# EAGLE schematic teensyMotors01 (EAGLE 9.1.3)

## Sheet 1 of 2
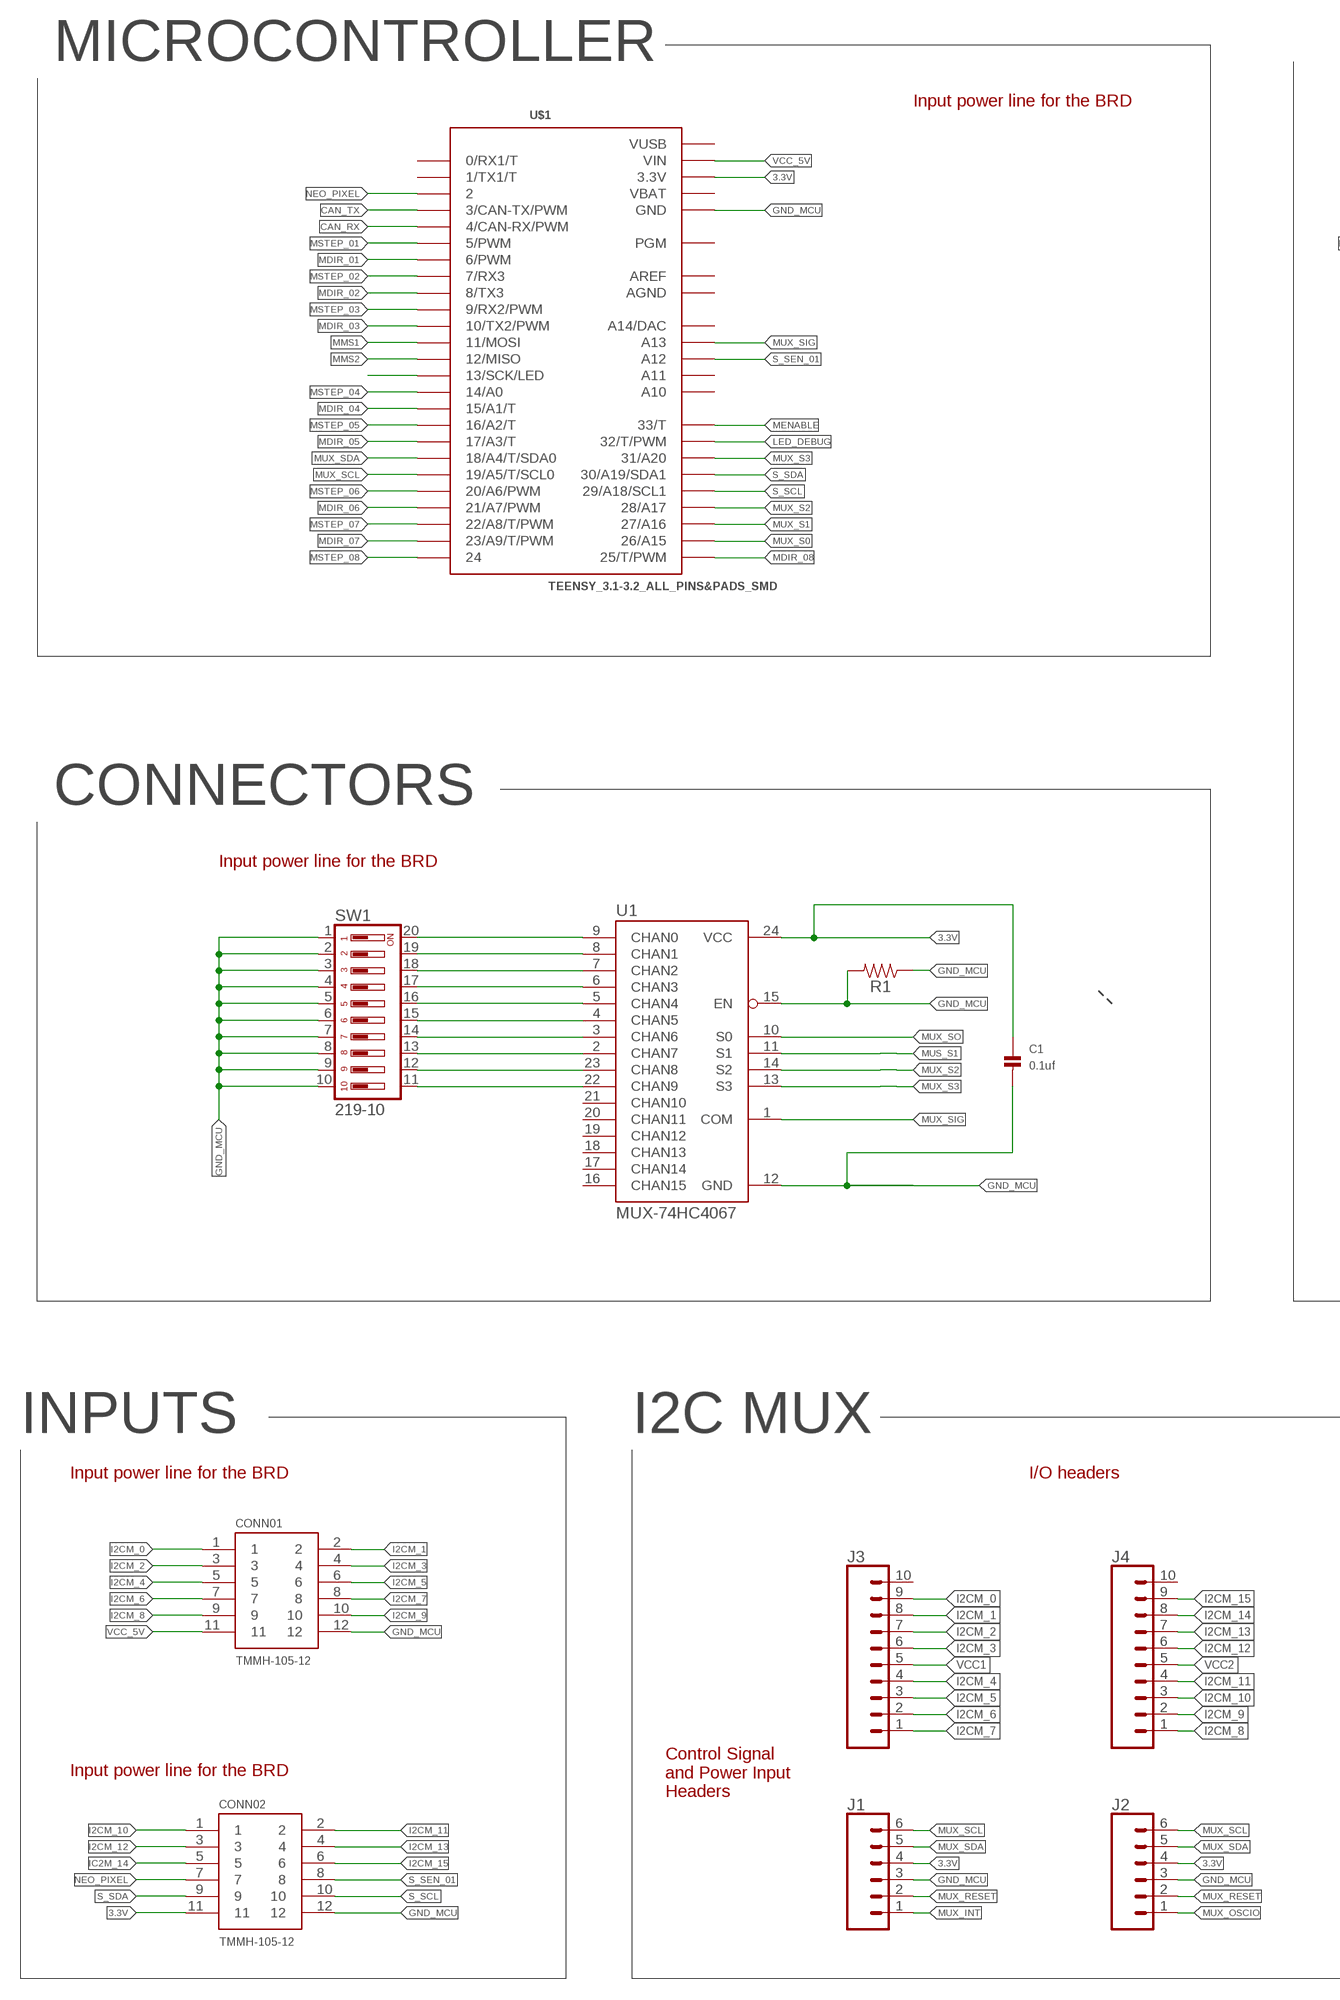
[diagram p0: schematic, sheet 1, part 1 of 2]
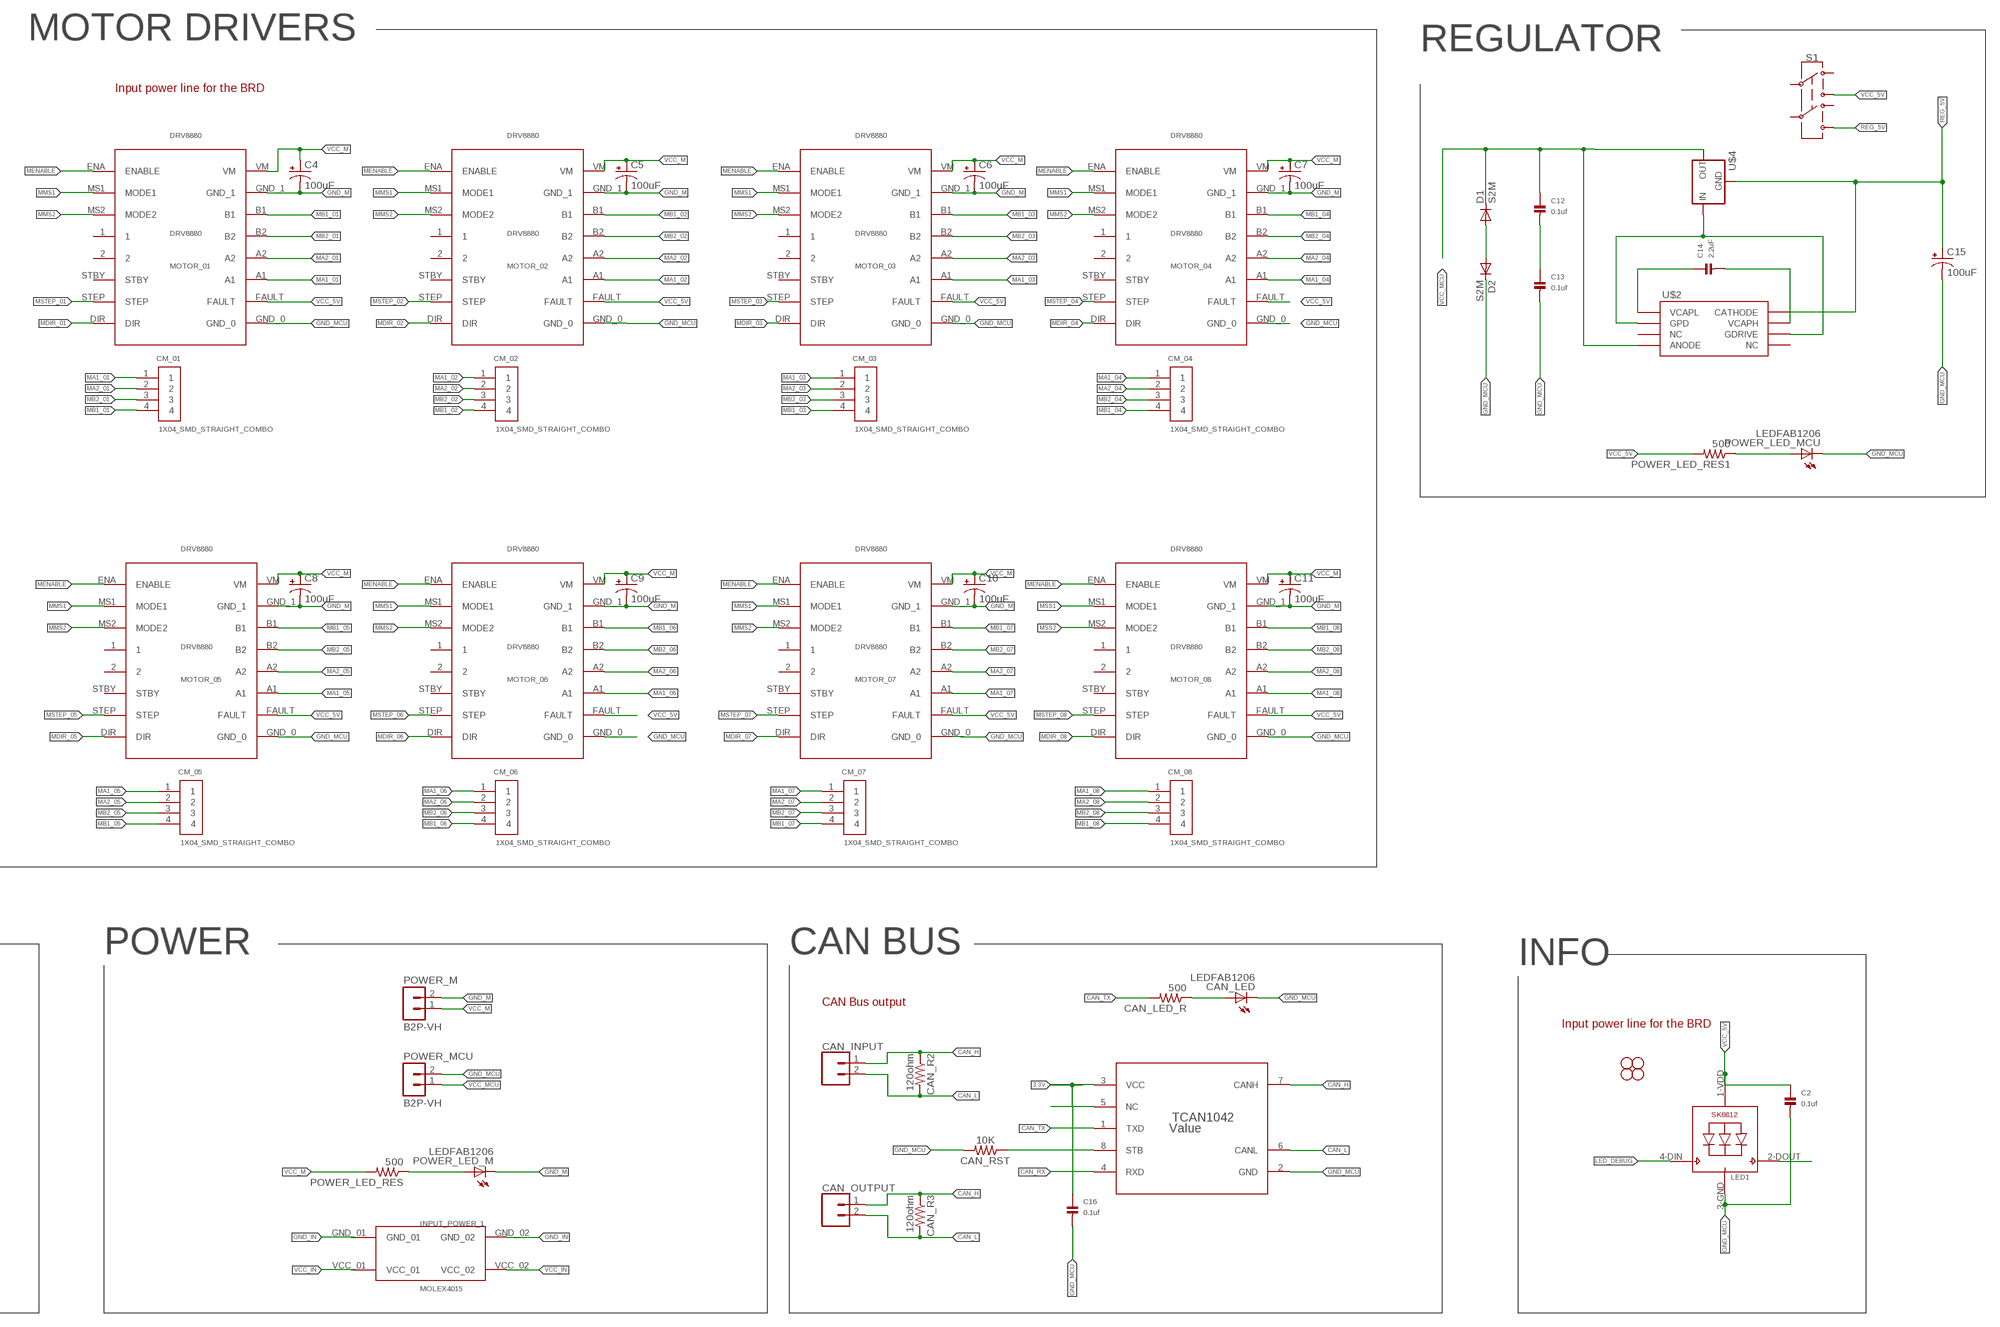
[diagram p1: schematic, sheet 1, part 2 of 2]

### Parts
C1  0.1uf  CAP_CERAMIC1206  [1206]
C2  0.1uf  CAP_CERAMIC1206  [1206]
C4  100uF  100UF-POLAR-25V-20%(ELEC)  [PANASONIC_D]
C5  100uF  100UF-POLAR-25V-20%(ELEC)  [PANASONIC_D]
C6  100uF  100UF-POLAR-25V-20%(ELEC)  [PANASONIC_D]
C7  100uF  100UF-POLAR-25V-20%(ELEC)  [PANASONIC_D]
C8  100uF  100UF-POLAR-25V-20%(ELEC)  [PANASONIC_D]
C9  100uF  100UF-POLAR-25V-20%(ELEC)  [PANASONIC_D]
C10  100uF  100UF-POLAR-25V-20%(ELEC)  [PANASONIC_D]
C11  100uF  100UF-POLAR-25V-20%(ELEC)  [PANASONIC_D]
C12  0.1uf  CAP_CERAMIC1206  [1206]
C13  0.1uf  CAP_CERAMIC1206  [1206]
C14  2.2uF  CAP_CERAMIC1206  [1206]
C15  100uF  100UF-POLAR-25V-20%(ELEC)  [PANASONIC_D]
C16  0.1uf  CAP_CERAMIC1206  [1206]
CAN_INPUT  CONN_02-JST-2MM-SMT  [JST-2-SMD]
CAN_LED  LEDFAB1206  [LED1206FAB]
CAN_LED_R  500  RES-US1206FAB  [R1206FAB]
CAN_OUTPUT  CONN_02-JST-2MM-SMT  [JST-2-SMD]
CAN_R2  120ohm  RESISTOR1206  [1206]
CAN_R3  120ohm  RESISTOR1206  [1206]
CAN_RST  10K  RESISTOR1206  [1206]
CM_01  1X04_SMD_STRAIGHT_COMBO  1X4-CLEANBIG  [1X04-CLEANBIG]
CM_02  1X04_SMD_STRAIGHT_COMBO  1X4-CLEANBIG  [1X04-CLEANBIG]
CM_03  1X04_SMD_STRAIGHT_COMBO  1X4-CLEANBIG  [1X04-CLEANBIG]
CM_04  1X04_SMD_STRAIGHT_COMBO  1X4-CLEANBIG  [1X04-CLEANBIG]
CM_05  1X04_SMD_STRAIGHT_COMBO  1X4-CLEANBIG  [1X04-CLEANBIG]
CM_06  1X04_SMD_STRAIGHT_COMBO  1X4-CLEANBIG  [1X04-CLEANBIG]
CM_07  1X04_SMD_STRAIGHT_COMBO  1X4-CLEANBIG  [1X04-CLEANBIG]
CM_08  1X04_SMD_STRAIGHT_COMBO  1X4-CLEANBIG  [1X04-CLEANBIG]
CONN01  TMMH-105-12  [TMMH-105-12]
CONN02  TMMH-105-12  [TMMH-105-12]
D1  S2M  [DO214AA]
D2  S2M  [DO214AA]
INPUT_POWER_1  MOLEX4015  [MOLEX4015]
J1  CONN_06SMD_MALE  [1X06_SMD_MALE]
J2  CONN_06SMD_MALE  [1X06_SMD_MALE]
J3  CONN_10SMD_MALE  [1X10_SMD_MALE]
J4  CONN_10SMD_MALE  [1X10_SMD_MALE]
LED1  SK6812_5050N  [LED5050_N]
MOTOR_01  DRV8880  [DRV8880]
MOTOR_02  DRV8880  [DRV8880]
MOTOR_03  DRV8880  [DRV8880]
MOTOR_04  DRV8880  [DRV8880]
MOTOR_05  DRV8880  [DRV8880]
MOTOR_06  DRV8880  [DRV8880]
MOTOR_07  DRV8880  [DRV8880]
MOTOR_08  DRV8880  [DRV8880]
POWER_LED_M  LEDFAB1206  [LED1206FAB]
POWER_LED_MCU  LEDFAB1206  [LED1206FAB]
POWER_LED_RES  500  RES-US1206FAB  [R1206FAB]
POWER_LED_RES1  500  RES-US1206FAB  [R1206FAB]
POWER_M  B2P-VH  [B2P-VH]
POWER_MCU  B2P-VH  [B2P-VH]
R1  RESISTOR1206  [1206]
S1  SWITCH-DPDT-SMD-AYZ0202  [SWITCH_DPDT_SMD_AYZ0202]
STANDOFF5  STAND-OFF  [STAND-OFF]
STANDOFF6  STAND-OFF  [STAND-OFF]
STANDOFF7  STAND-OFF  [STAND-OFF]
STANDOFF8  STAND-OFF  [STAND-OFF]
SW1  219-10  [CTS-219-10]
TCAN1042  Value  TCAN1042DRQ1  [D0008A_N]
U1  MUX-74HC4067  MUX-74HC4067SMD  [SSOP24]
U$1  TEENSY_3.1-3.2_ALL_PINS&PADS_SMD  [TEENSY_3.0-3.2_ALL_PINS_&_PADS_SMD]
U$2  LM74610-Q1  [VSSOP(8)]
U$4  BUK  [TO263-3]

### Nets
3.3V: C1.1 C16.1 CONN02.11 J1.4 J2.4 TCAN1042.3(VCC) U1.24(VCC) U$1.3.3V U$1.3.3V1(3.3V) U$1.3.3V2(3.3V)
C0: SW1.20 U1.9(CHAN0)
C1: SW1.19 U1.8(CHAN1)
C2: SW1.18 U1.7(CHAN2)
C3: SW1.17 U1.6(CHAN3)
C4: SW1.16 U1.5(CHAN4)
C5: SW1.15 U1.4(CHAN5)
C6: SW1.14 U1.3(CHAN6)
C7: SW1.13 U1.2(CHAN7)
C8: SW1.12 U1.23(CHAN8)
C9: SW1.11 U1.22(CHAN9)
CAN_H: CAN_INPUT.1 CAN_OUTPUT.1 CAN_R2.1 CAN_R3.1 TCAN1042.7(CANH)
CAN_L: CAN_INPUT.2 CAN_OUTPUT.2 CAN_R2.2 CAN_R3.2 TCAN1042.6(CANL)
CAN_RX: TCAN1042.4(RXD) U$1.4(4/CAN-RX/PWM)
CAN_TX: CAN_LED_R.2 TCAN1042.1(TXD) U$1.3(3/CAN-TX/PWM)
GND_IN: INPUT_POWER_1.GND_01 INPUT_POWER_1.GND_02
GND_M: C4.- C5.- C6.- C7.- C8.- C9.- C10.- C11.- MOTOR_01.GND_1 MOTOR_02.GND_1 MOTOR_03.GND_1 MOTOR_04.GND_1 MOTOR_05.GND_1 MOTOR_06.GND_1 MOTOR_07.GND_1 MOTOR_08.GND_1 POWER_LED_M.2(C) POWER_M.2
GND_MCU: C1.2 C2.2 C13.2 C15.- C16.2 CAN_LED.2(C) CAN_RST.2 CONN01.12 CONN02.12 D2.C J1.3 J2.3 LED1.3-GND(GND) MOTOR_01.GND_0 MOTOR_02.GND_0 MOTOR_03.GND_0 MOTOR_04.GND_0 MOTOR_05.GND_0 MOTOR_06.GND_0 MOTOR_07.GND_0 MOTOR_08.GND_0 POWER_LED_MCU.2(C) POWER_MCU.2 R1.1 R1.2 SW1.1 SW1.2 SW1.3 SW1.4 SW1.5 SW1.6 SW1.7 SW1.8 SW1.9 SW1.10 TCAN1042.2(GND) U1.12(GND) U1.15(EN) U$1.GND U$1.GND1(GND) U$1.GND2(GND)
I2CM_0: CONN01.1 J3.9
I2CM_1: CONN01.2 J3.8
I2CM_2: CONN01.3 J3.7
I2CM_3: CONN01.4 J3.6
I2CM_4: CONN01.5 J3.4
I2CM_5: CONN01.6 J3.3
I2CM_6: CONN01.7 J3.2
I2CM_7: CONN01.8 J3.1
I2CM_8: CONN01.9 J4.1
I2CM_9: CONN01.10 J4.2
I2CM_10: CONN02.1 J4.3
I2CM_11: CONN02.2 J4.4
I2CM_12: CONN02.3 J4.6
I2CM_13: CONN02.4 J4.7
I2CM_14: J4.8
I2CM_15: CONN02.6 J4.9
IC2M_14: CONN02.5
LED_DEBUG: LED1.4-DIN(DI) U$1.32(32/T/PWM)
MA1_01: CM_01.1 MOTOR_01.A1
MA1_02: CM_02.1 MOTOR_02.A1
MA1_03: CM_03.1 MOTOR_03.A1
MA1_04: CM_04.1 MOTOR_04.A1
MA1_05: CM_05.1 MOTOR_05.A1
MA1_06: CM_06.1 MOTOR_06.A1
MA1_07: CM_07.1 MOTOR_07.A1
MA1_08: CM_08.1 MOTOR_08.A1
MA2_01: CM_01.2 MOTOR_01.A2
MA2_02: CM_02.2 MOTOR_02.A2
MA2_03: CM_03.2 MOTOR_03.A2
MA2_04: CM_04.2 MOTOR_04.A2
MA2_05: CM_05.2 MOTOR_05.A2
MA2_06: CM_06.2 MOTOR_06.A2
MA2_07: CM_07.2 MOTOR_07.A2
MA2_08: CM_08.2 MOTOR_08.A2
MB1_01: CM_01.4 MOTOR_01.B1
MB1_02: CM_02.4 MOTOR_02.B1
MB1_03: CM_03.4 MOTOR_03.B1
MB1_04: CM_04.4 MOTOR_04.B1
MB1_05: CM_05.4 MOTOR_05.B1
MB1_06: CM_06.4 MOTOR_06.B1
MB1_07: CM_07.4 MOTOR_07.B1
MB1_08: CM_08.4 MOTOR_08.B1
MB2_01: CM_01.3 MOTOR_01.B2
MB2_02: CM_02.3 MOTOR_02.B2
MB2_03: CM_03.3 MOTOR_03.B2
MB2_04: CM_04.3 MOTOR_04.B2
MB2_05: CM_05.3 MOTOR_05.B2
MB2_06: CM_06.3 MOTOR_06.B2
MB2_07: CM_07.3 MOTOR_07.B2
MB2_08: CM_08.3 MOTOR_08.B2
MDIR_01: MOTOR_01.DIR U$1.6(6/PWM)
MDIR_02: MOTOR_02.DIR U$1.8(8/TX3)
MDIR_03: MOTOR_03.DIR U$1.10(10/TX2/PWM)
MDIR_04: MOTOR_04.DIR U$1.15/A1(15/A1/T)
MDIR_05: MOTOR_05.DIR U$1.17/A3(17/A3/T)
MDIR_06: MOTOR_06.DIR U$1.21/A7(21/A7/PWM)
MDIR_07: MOTOR_07.DIR U$1.23/A9(23/A9/T/PWM)
MDIR_08: MOTOR_08.DIR U$1.25(25/T/PWM)
MENABLE: MOTOR_01.ENA(ENABLE) MOTOR_02.ENA(ENABLE) MOTOR_03.ENA(ENABLE) MOTOR_04.ENA(ENABLE) MOTOR_05.ENA(ENABLE) MOTOR_06.ENA(ENABLE) MOTOR_07.ENA(ENABLE) MOTOR_08.ENA(ENABLE) U$1.33(33/T)
MMS1: MOTOR_01.MS1(MODE1) MOTOR_02.MS1(MODE1) MOTOR_03.MS1(MODE1) MOTOR_04.MS1(MODE1) MOTOR_05.MS1(MODE1) MOTOR_06.MS1(MODE1) MOTOR_07.MS1(MODE1) U$1.11(11/MOSI)
MMS2: MOTOR_01.MS2(MODE2) MOTOR_02.MS2(MODE2) MOTOR_03.MS2(MODE2) MOTOR_04.MS2(MODE2) MOTOR_05.MS2(MODE2) MOTOR_06.MS2(MODE2) MOTOR_07.MS2(MODE2) U$1.12(12/MISO)
MSS1: MOTOR_08.MS1(MODE1)
MSS2: MOTOR_08.MS2(MODE2)
MSTEP_01: MOTOR_01.STEP U$1.5(5/PWM)
MSTEP_02: MOTOR_02.STEP U$1.7(7/RX3)
MSTEP_03: MOTOR_03.STEP U$1.9(9/RX2/PWM)
MSTEP_04: MOTOR_04.STEP U$1.14/A0
MSTEP_05: MOTOR_05.STEP U$1.16/A2(16/A2/T)
MSTEP_06: MOTOR_06.STEP U$1.20/A6(20/A6/PWM)
MSTEP_07: MOTOR_07.STEP U$1.22/A8(22/A8/T/PWM)
MSTEP_08: MOTOR_08.STEP U$1.24
MUS_S1: U1.11(S1)
MUX_INT: J1.1
MUX_OSCIO: J2.1
MUX_RESET: J1.2 J2.2
MUX_S0: U$1.26(26/A15)
MUX_S1: U$1.27(27/A16)
MUX_S2: U1.14(S2) U$1.28(28/A17)
MUX_S3: U1.13(S3) U$1.31(31/A20)
MUX_SCL: J1.6 J2.6 U$1.19/A5(19/A5/T/SCL0)
MUX_SDA: J1.5 J2.5 U$1.18/A4(18/A4/T/SDA0)
MUX_SIG: U1.1(COM) U$1.A13
MUX_SO: U1.10(S0)
N$1: POWER_LED_M.1(A) POWER_LED_RES.1
N$2: C14.2 U$2.VCAPH
N$3: TCAN1042.5(NC)
N$4: U$2.GDRIVE U$2.GPD U$4.1(IN)
N$5: C14.1 U$2.VCAPL
N$6: CAN_RST.1 TCAN1042.8(STB)
N$7: POWER_LED_MCU.1(A) POWER_LED_RES1.1
N$9: C12.2 C13.1
N$11: U$1.13(13/SCK/LED)
N$12: D1.A D2.A
N$13: LED1.2-DOUT(DO)
N$193: CAN_LED.1(A) CAN_LED_R.1
NEO_PIXEL: CONN02.7 U$1.2
REG_5V: C15.+ S1.6 U$2.CATHODE U$4.4(GND)
S_SCL: CONN02.10 U$1.29(29/A18/SCL1)
S_SDA: CONN02.9 U$1.30(30/A19/SDA1)
S_SEN_01: CONN02.8 U$1.A12
VCC1: J3.5
VCC2: J4.5
VCC_5V: C2.1 CONN01.11 LED1.1-VDD(VDD) MOTOR_01.FAULT MOTOR_02.FAULT MOTOR_03.FAULT MOTOR_04.FAULT MOTOR_05.FAULT MOTOR_06.FAULT MOTOR_07.FAULT MOTOR_08.FAULT POWER_LED_RES1.2 S1.3 U$1.VIN
VCC_IN: INPUT_POWER_1.VCC_01 INPUT_POWER_1.VCC_02
VCC_M: C4.+ C5.+ C6.+ C7.+ C8.+ C9.+ C10.+ C11.+ MOTOR_01.VM MOTOR_02.VM MOTOR_03.VM MOTOR_04.VM MOTOR_05.VM MOTOR_06.VM MOTOR_07.VM MOTOR_08.VM POWER_LED_RES.2 POWER_M.1
VCC_MCU: C12.1 D1.C POWER_MCU.1 U$2.ANODE U$4.3(OUT)
Unconnected: J3.10 J4.10 MOTOR_01.1 MOTOR_01.2 MOTOR_01.STBY MOTOR_02.1 MOTOR_02.2 MOTOR_02.STBY MOTOR_03.1 MOTOR_03.2 MOTOR_03.STBY MOTOR_04.1 MOTOR_04.2 MOTOR_04.STBY MOTOR_05.1 MOTOR_05.2 MOTOR_05.STBY MOTOR_06.1 MOTOR_06.2 MOTOR_06.STBY MOTOR_07.1 MOTOR_07.2 MOTOR_07.STBY MOTOR_08.1 MOTOR_08.2 MOTOR_08.STBY S1.1 S1.2 S1.4 S1.5 U1.16(CHAN15) U1.17(CHAN14) U1.18(CHAN13) U1.19(CHAN12) U1.20(CHAN11) U1.21(CHAN10) U$1.0(0/RX1/T) U$1.1(1/TX1/T) U$1.A10 U$1.A11 U$1.PGM U$1.RESET/DAC(A14/DAC) U$2.NC@1(NC) U$2.NC@2(NC)

### Notes on the sheet
- MICROCONTROLLER | MOTOR DRIVERS | REGULATOR
- Input power line for the BRD
- Input power line for the BRD
- CONNECTORS
- Input power line for the BRD
- INPUTS | I2C MUX | POWER | CAN BUS | INFO
- Input power line for the BRD | I/O headers
- CAN Bus output
- Input power line for the BRD
- Control Signal
  and Power Input
  Headers
- Input power line for the BRD

## Sheet 2 of 2

## Power pins joined to a net without a drawn wire
AGND: U$1.AGND
AREF: U$1.AREF
VBAT: U$1.VBAT
VUSB: U$1.VUSB

## Library data of the parts
C1 C2 C12-C14 C16 = microbuilder:CAP_CERAMIC: Ceramic Capacitors 0402 - 0402 Surface Mount Capacitors 16pF 50V 5% [Digikey: 445-4899-2-ND] 18pF 50V 5% [Digikey: 490-1281-2-ND] 22pF 50V 5% [Digikey: 490-1283-2-ND] 68pF 50V 5% [Digikey: 490-1289-2-ND] 0.1uF 10V 10% [Digikey: 490-1318-2-ND] 1.0uF 6.3V 10% [Digikey: 490-1320-2-ND] 0603 - 0603 Surface Mount Capacitors 16 pF 50V 5% [Digikey: 445-5051-2-ND] 22 pF 50V [Digikey: PCC220ACVTR-ND] 33 pF 50V 5% [Digikey: 490-1415-1-ND] 56pF 50V 5% [Digikey: 490-1421-1-ND] 220pF 50V 5% [Digikey: 445-1285-1-ND] 680 pF 50V 2200 pF 50V 5% C0G [Digikey: 445-1297-1-ND] 5600 pF 100V 5% X7R [Digikey: 478-3711-1-ND] 0.1 µF 25V 10% [Digikey: PCC2277TR-ND] 0.22 µF 16V 10% X7R [Digikey: 445-1318-1-ND] 1.0 µF 25V 10% [Digikey: 445-5146-2-ND] 0603 - RF Specific 3pF 250V +/-0.1pF RF [Digikey: 712-1347-1-ND] 18 pF 250V 5% [Digikey: 478-3505-1-ND or 712-1322-1-ND] 56 pF 250V 5% C0G RF [Digikey: 490-4867-1-ND] 68 pF 250V RF [Digikey: 490-4868-1-ND] 0805 - 0805 Surface Mount Capacitors 220 pF 250V 2% RF Ceramic Capacitor [Digikey: 712-1398-1-ND] 1000 pF 50V 2% NP0 Ceramic Capacitor [Digikey: 478-3760-1-ND] 0.1 µF 25V 10% Ceramic Capacitor [Digikey: PCC1828TR-ND] 1.0 µF 16V 10% Ceramic Capacitor[Digikey: 490-1691-2-ND] 10.0 µF 10V 10% Ceramic Capacitor[Digikey: 709-1228-1-ND] 10.0 uF 16V 10% Ceramic Capacitor [Digikey: 478-5165-2-ND] 47 uF 6.3V 20% Ceramic Capacitor [Digikey: 587-1779-1-ND or 399-5506-1-ND] 1206 - 1206 Surface Mount Capacitors 47uF 10V 20% Ceramic Capacitor [Digikey: 490-5528-1-ND or 399-5508-1-ND or 445-6010-1-ND] 100uF 6.3V -20%, +80% Y5V Ceramic Capacitor (Digikey: 490-4512-1-ND, Mouser: 81-GRM31CF50J107ZE1L)
C4-C11 C15 = SparkFun-Capacitors:100UF-POLAR: 100µF polarized capacitors A capacitor is a passive two-terminal electrical component used to store electrical energy temporarily in an electric field.; PROD_ID: CAP-12547
CAN_INPUT CAN_OUTPUT = SparkFun-Connectors:CONN_02: Multi connection point. Often used as Generic Header-pin footprint for 0.1 inch spaced/style header connections On any of the 0.1 inch spaced packages, you can populate with these: Break Away Headers - Straight <https://www.sparkfun.com/products/116> (PRT-00116) Break Away Male Headers - Right Angle <https://www.sparkfun.com/products/553> (PRT-00553) Female Headers <https://www.sparkfun.com/products/115> (PRT-00115) Break Away Headers - Machine Pin <https://www.sparkfun.com/products/117> (PRT-00117) Break Away Female Headers - Swiss Machine Pin <https://www.sparkfun.com/products/743> (PRT-00743) For SCREWTERMINALS and SPRING TERMINALS visit here: Screw Terimnals on SparkFun.com <https://www.sparkfun.com/search/results?term=Screw+Terminals> (5mm/3.5mm/2.54mm spacing) This device is also useful as a general connection point to wire up your design to another part of your project. Our various solder wires solder well into these plated through hole pads. Hook-Up Wire - Assortment (Stranded, 22 AWG) <https://www.sparkfun.com/products/11375> (PRT-11375) Hook-Up Wire - Assortment (Solid Core, 22 AWG) <https://www.sparkfun.com/products/11367> (PRT-11367) View the entire wire category on our website here <https://www.sparkfun.com/categories/141> Special notes: Molex polarized connector foot print use with: PRT-08233 with associated crimp pins and housings. 2.54_SCREWTERM for use with PRT-10571. 3.5mm Screw Terminal footprints for PRT-08084 5mm Screw Terminal footprints for use with PRT-08432; PROD_ID: CONN-11443
CAN_LED POWER_LED_M POWER_LED_MCU = fab:LED: LED
CAN_LED_R POWER_LED_RES POWER_LED_RES1 = fab:RES-US: Resistor (US Symbol) Variants with postfix FAB are widened to allow the routing of internal traces
CAN_R2 CAN_R3 CAN_RST R1 = SparkFun-Resistors:RESISTOR: Generic Resistor Package
CM_01-CM_08 = adafruit:1X4: 4-pin connector
CONN01 CONN02 = TMMH-105-XX-XX-DV:TMMH-105-12: 2mm (.0787") Flex Shroud, .020" (.51mm) Square Post Terminal Strip, Surface Mount,10 Pins.
D1 D2 = s2x_10:S2*: S2A - S2M General Purpose Rectifiers Source: http://www.fairchildsemi.com/datasheets/S2/S2A.pdf; MF: Fairchild; MPN: S2M; OC_FARNELL: 9843876; OC_NEWARK: 58K9553
INPUT_POWER_1 = MOLEX4015:MOLEX4015
J1 J2 = SparkFun-Connectors:CONN_06: Multi connection point. Often used as Generic Header-pin footprint for 0.1 inch spaced/style header connections On any of the 0.1 inch spaced packages, you can populate with these: Break Away Headers - Straight <https://www.sparkfun.com/products/116> (PRT-00116) Break Away Male Headers - Right Angle <https://www.sparkfun.com/products/553> (PRT-00553) Female Headers <https://www.sparkfun.com/products/115> (PRT-00115) Break Away Headers - Machine Pin <https://www.sparkfun.com/products/117> (PRT-00117) Break Away Female Headers - Swiss Machine Pin <https://www.sparkfun.com/products/743> (PRT-00743) Arduino Stackable Header - 6 Pin <https://www.sparkfun.com/products/9280> (PRT-09280) For SCREWTERMINALS and SPRING TERMINALS visit here: Screw Terimnals on SparkFun.com <https://www.sparkfun.com/search/results?term=Screw+Terminals> (5mm/3.5mm/2.54mm spacing) This device is also useful as a general connection point to wire up your design to another part of your project. Our various solder wires solder well into these plated through hole pads. Hook-Up Wire - Assortment (Stranded, 22 AWG) <https://www.sparkfun.com/products/11375> (PRT-11375) Hook-Up Wire - Assortment (Solid Core, 22 AWG) <https://www.sparkfun.com/products/11367> (PRT-11367) View the entire wire category on our website here <https://www.sparkfun.com/categories/141>; PROD_ID: CONN-11293
J3 J4 = SparkFun-Connectors:CONN_10: Multi connection point. Often used as Generic Header-pin footprint for 0.1 inch spaced/style header connections On any of the 0.1 inch spaced packages, you can populate with these: Break Away Headers - Straight <https://www.sparkfun.com/products/116> (PRT-00116) Break Away Male Headers - Right Angle <https://www.sparkfun.com/products/553> (PRT-00553) Female Headers <https://www.sparkfun.com/products/115> (PRT-00115) Break Away Headers - Machine Pin <https://www.sparkfun.com/products/117> (PRT-00117) Break Away Female Headers - Swiss Machine Pin <https://www.sparkfun.com/products/743> (PRT-00743) Arduino Stackable Header - 10 Pin <https://www.sparkfun.com/products/11376> (PRT-11376) For SCREWTERMINALS and SPRING TERMINALS visit here: Screw Terimnals on SparkFun.com <https://www.sparkfun.com/search/results?term=Screw+Terminals> (5mm/3.5mm/2.54mm spacing) This device is also useful as a general connection point to wire up your design to another part of your project. Our various solder wires solder well into these plated through hole pads. Hook-Up Wire - Assortment (Stranded, 22 AWG) <https://www.sparkfun.com/products/11375> (PRT-11375) Hook-Up Wire - Assortment (Solid Core, 22 AWG) <https://www.sparkfun.com/products/11367> (PRT-11367) View the entire wire category on our website here <https://www.sparkfun.com/categories/141> Special notes: Molex polarized connector foot print use with SKU : PRT-08231 with associated crimp pins and housings. 1MM SMD Version SKU: PRT-10208 NOTES ON THE VARIANTS LOCK and LOCK_LONGPADS... This footprint was designed to help hold the alignment of a through-hole component (i.e. 6-pin header) while soldering it into place. You may notice that each hole has been shifted either up or down by 0.005 of an inch from it's more standard position (which is a perfectly straight line). This slight alteration caused the pins (the squares in the middle) to touch the edges of the holes. Because they are alternating, it causes a "brace" to hold the component in place. 0.005 has proven to be the perfect amount of "off-center" position when using our standard breakaway headers. Although looks a little odd when you look at the bare footprint, once you have a header in there, the alteration is very hard to notice. Also,if you push a header all the way into place, it is covered up entirely on the bottom side.; PROD_ID: CONN-11291
LED1 = SK6812:SK6812
MOTOR_01-MOTOR_08 = STSPIN220:DRV8880
POWER_M POWER_MCU = con-JST VH:B2P-VH: JST VH Series header 3.96mm pitch disconnectable crimp style connectors, vertical (side entry type), 2 pins
S1 = SparkFun-Switches:SWITCH-DPDT: Double-Pole, Double-Throw (DPDT) Switch Double-pole, double-throw switches. Variant Overview PTH-GPI-152-3013 Used on SparkFun Geiger Counter <https://www.sparkfun.com/products/11345> SMD-AY0202 Surface Mount DPDT Switch <https://www.sparkfun.com/products/597> (COM-00597) Used on e.g. LilyPad Arduino USB - ATmega32U4 Board <https://www.sparkfun.com/products/12049>; PROD_ID: SWCH-08179; SF_SKU: COM-00597; SPICEPREFIX: X
STANDOFF5-STANDOFF8 = SparkFun-Electromechanical:STAND-OFF: #4 Stand Off This is the mechanical footprint for a #4 phillips button head screw. Use the keepout ring to avoid running the screw head into surrounding components. SKU : PRT-00447
SW1 = switch-dil:219-10*: Surface Mount DIP Switch Series 219 SMT CTS Electronic Components Sourc: www.ctscorp.com; MF: SLI (CML/IDI); MPN: 219-10PK; OC_FARNELL: unknown; OC_NEWARK: 19M0224
TCAN1042 = TCAN1042DRQ1:TCAN1042DRQ1; MANUFACTURER: Texas Instruments; PARTNUMBER: TCAN1042DRQ1; REFDES: RefDes; TYPE: TYPE
U1 = SparkFun:MUX-74HC4067
U$1 = Teensy_3_and_LC_Series_Boards_v1.4:TEENSY_3.1-3.2_ALL_PINS&PADS_SMD: Footprint for Teensy 3.1 or 3.2 board using all pads and all through-holes. Pads need a 2x7 0.1" SMD header.
U$2 = 1zac:LM74610-Q1: LM74610-Q1 Zero IQ Reverse Polarity Protection Smart Diode Controller; MPN: LM74610-Q1
U$4 = v-reg-2:BUK

## Net classes
0 default: width 0.2 mm, clearance 0.205 mm
1 2oz: width 0.2 mm